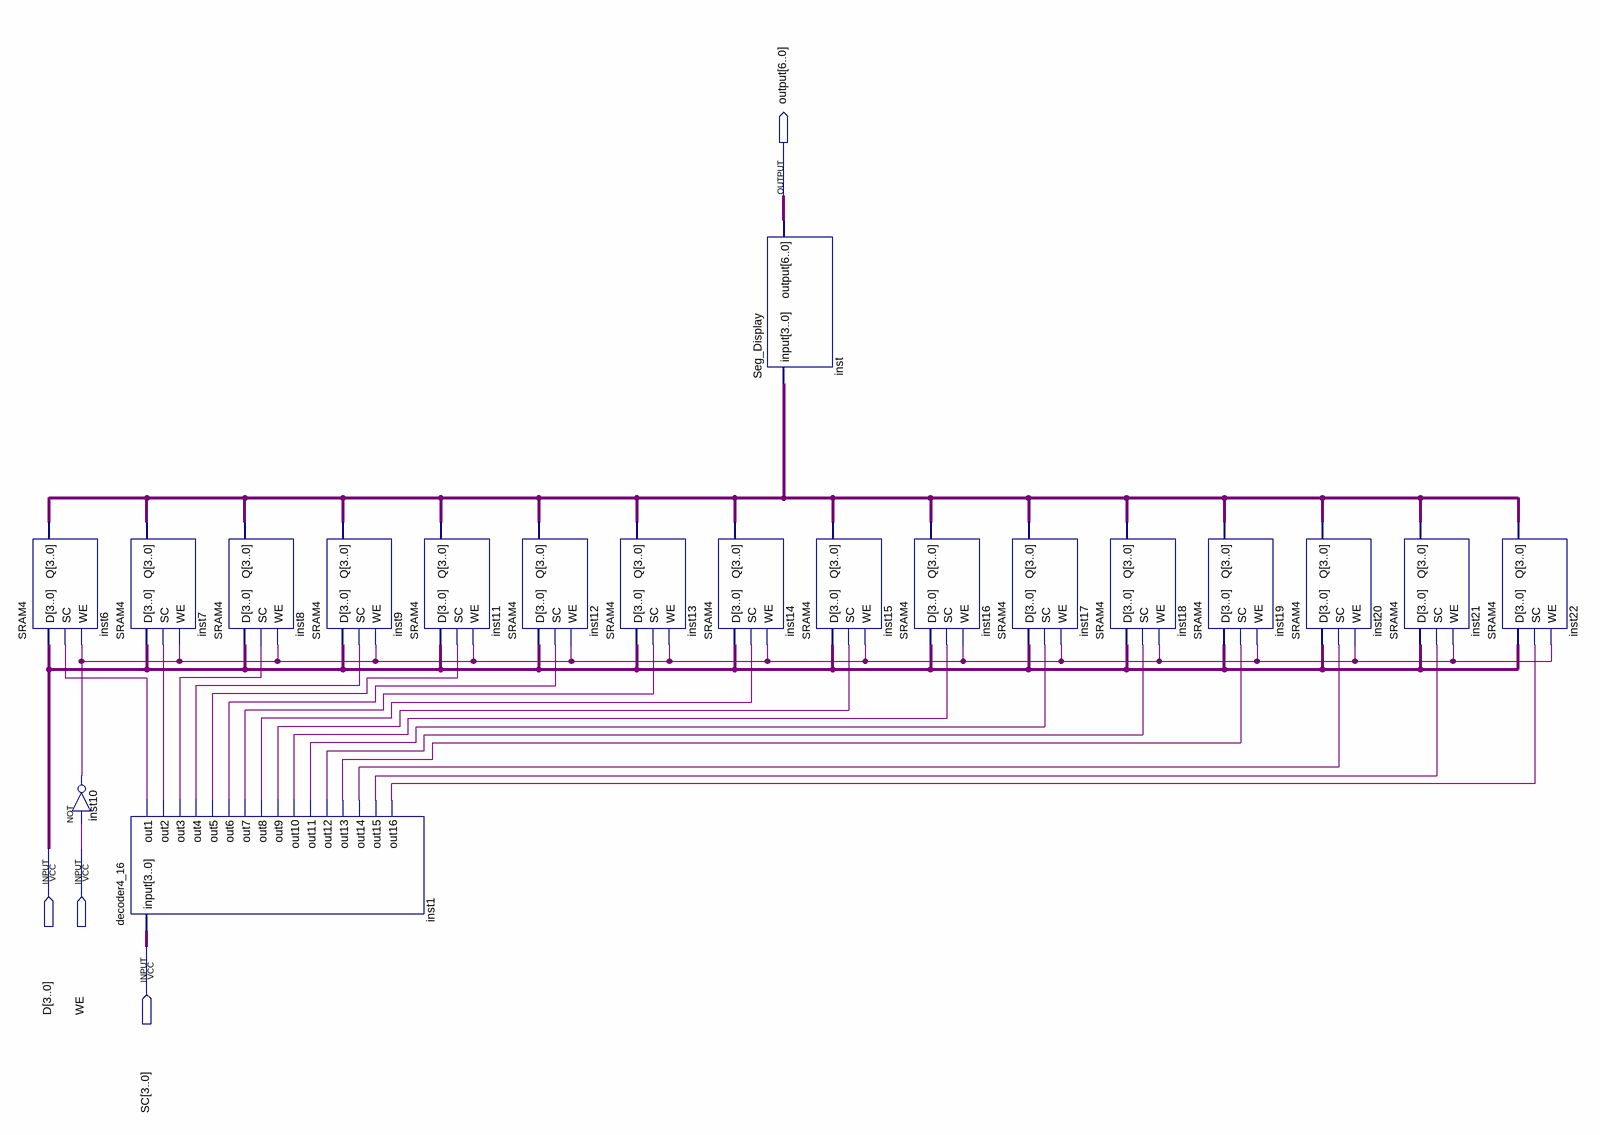
[diagram p0: schematic sheet]
// Quartus schematic SRAM16.bdf as structural Verilog: 19 symbols, 4 pins
module SRAM16 (
  input  [3:0] D,
  input  WE,
  input  [3:0] SC,
  output [6:0] \output 
);

  wire inst1_out1, inst1_out2, inst1_out3, inst1_out4, inst1_out5, inst1_out6, inst1_out7, inst1_out8,
       inst1_out9, inst1_out10, inst1_out11, inst1_out12, inst1_out13, inst1_out14, inst1_out15, inst1_out16,
       inst10_out;
  wire [3:0] inst6_q;

  SRAM4 inst6 (.D(D), .SC(inst1_out1), .WE(inst10_out), .Q(inst6_q));
  not inst10 (inst10_out, WE);
  SRAM4 inst7 (.D(D), .SC(inst1_out2), .WE(inst10_out), .Q(inst6_q));
  decoder4_16 inst1 (
    .\input (SC), .out1(inst1_out1), .out2(inst1_out2), .out3(inst1_out3), .out4(inst1_out4),
    .out5(inst1_out5), .out6(inst1_out6), .out7(inst1_out7), .out8(inst1_out8), .out9(inst1_out9),
    .out10(inst1_out10), .out11(inst1_out11), .out12(inst1_out12), .out13(inst1_out13), .out14(inst1_out14),
    .out15(inst1_out15), .out16(inst1_out16));
  SRAM4 inst8 (.D(D), .SC(inst1_out3), .WE(inst10_out), .Q(inst6_q));
  SRAM4 inst9 (.D(D), .SC(inst1_out4), .WE(inst10_out), .Q(inst6_q));
  SRAM4 inst11 (.D(D), .SC(inst1_out5), .WE(inst10_out), .Q(inst6_q));
  SRAM4 inst12 (.D(D), .SC(inst1_out6), .WE(inst10_out), .Q(inst6_q));
  SRAM4 inst13 (.D(D), .SC(inst1_out7), .WE(inst10_out), .Q(inst6_q));
  SRAM4 inst14 (.D(D), .SC(inst1_out8), .WE(inst10_out), .Q(inst6_q));
  Seg_Display inst (.\input (inst6_q), .\output (\output ));
  SRAM4 inst15 (.D(D), .SC(inst1_out9), .WE(inst10_out), .Q(inst6_q));
  SRAM4 inst16 (.D(D), .SC(inst1_out10), .WE(inst10_out), .Q(inst6_q));
  SRAM4 inst17 (.D(D), .SC(inst1_out11), .WE(inst10_out), .Q(inst6_q));
  SRAM4 inst18 (.D(D), .SC(inst1_out12), .WE(inst10_out), .Q(inst6_q));
  SRAM4 inst19 (.D(D), .SC(inst1_out13), .WE(inst10_out), .Q(inst6_q));
  SRAM4 inst20 (.D(D), .SC(inst1_out14), .WE(inst10_out), .Q(inst6_q));
  SRAM4 inst21 (.D(D), .SC(inst1_out15), .WE(inst10_out), .Q(inst6_q));
  SRAM4 inst22 (.D(D), .SC(inst1_out16), .WE(inst10_out), .Q(inst6_q));
endmodule
